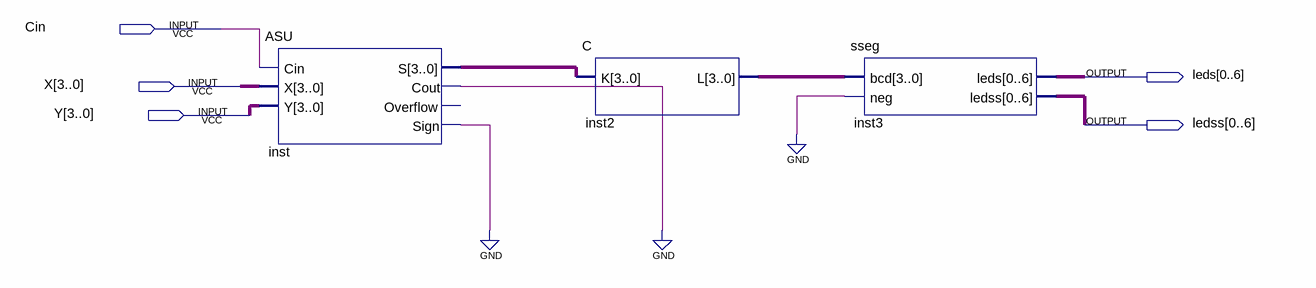
[diagram p0: schematic sheet]
// Quartus schematic CombinedASU2.bdf as structural Verilog: 3 symbols, 5 pins
module CombinedASU2 (
  input  Cin,
  input  [3:0] X,
  input  [3:0] Y,
  output [0:6] leds,
  output [0:6] ledss
);

  wire inst_cout, inst_sign;
  wire [3:0] inst2_l, inst_s;

  ASU inst (.Cin(Cin), .X(X), .Y(Y), .S(inst_s), .Cout(inst_cout), .Sign(inst_sign));  // open: Overflow
  C inst2 (.K(inst_s), .L(inst2_l));
  sseg inst3 (.bcd(inst2_l), .neg(1'b0), .leds(leds), .ledss(ledss));
  // also tied to GND on the sheet: {inst_sign, inst_cout}
endmodule
